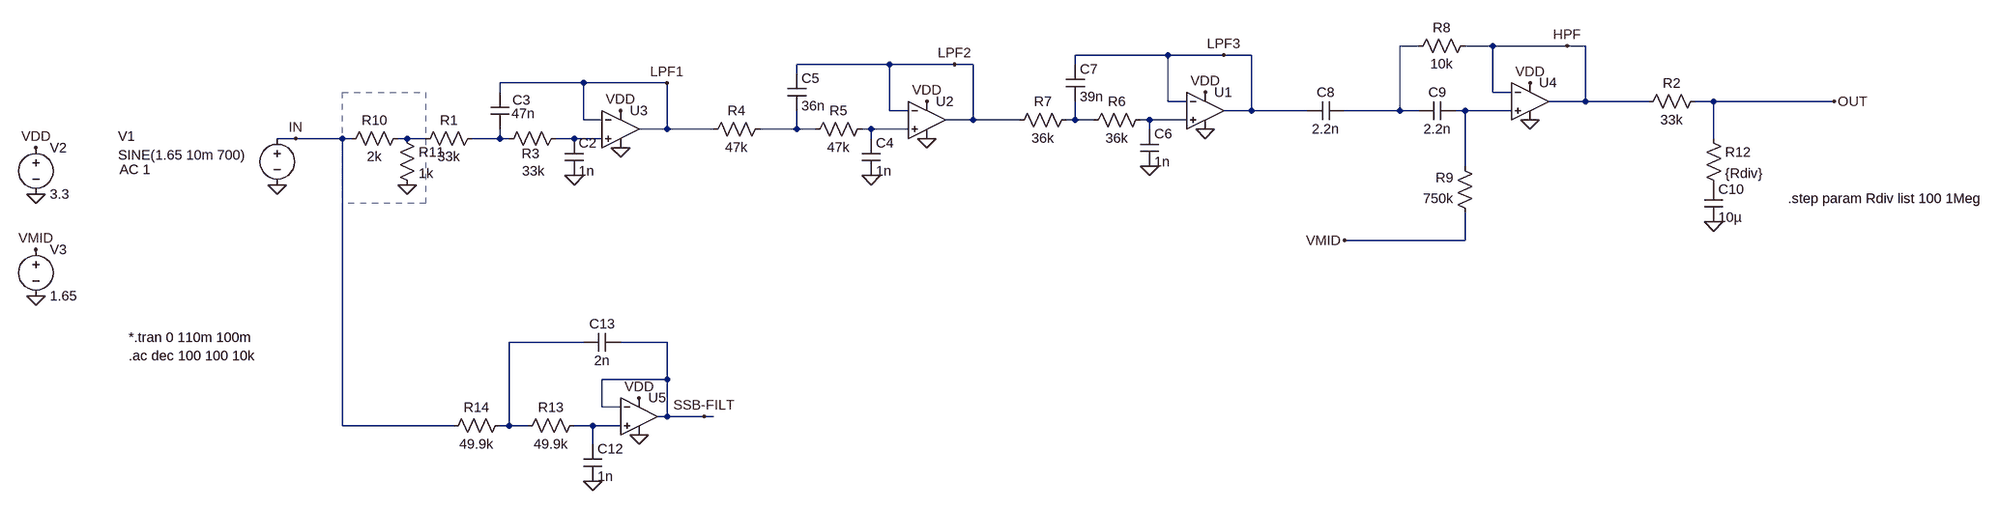
[diagram p0: schematic NM0S Hipermite - Modified.asc]
NM0S Hipermite - Modified.asc, the LTspice schematic file:
Version 4
SHEET 1 3216 724
WIRE 1776 -304 1744 -304
WIRE 1904 -304 1856 -304
WIRE 2032 -304 1904 -304
WIRE 2064 -304 2032 -304
WIRE 1344 -288 1184 -288
WIRE 1440 -288 1344 -288
WIRE 1488 -288 1440 -288
WIRE 864 -272 704 -272
WIRE 976 -272 864 -272
WIRE 1008 -272 976 -272
WIRE 1184 -272 1184 -288
WIRE 704 -256 704 -272
WIRE 336 -240 192 -240
WIRE 480 -240 336 -240
WIRE 192 -224 192 -240
WIRE 1904 -224 1904 -304
WIRE 1936 -224 1904 -224
WIRE 1344 -208 1344 -288
WIRE 1376 -208 1344 -208
WIRE 2064 -208 2064 -304
WIRE 2064 -208 2000 -208
WIRE 2256 -208 2064 -208
WIRE 2368 -208 2336 -208
WIRE 2576 -208 2368 -208
WIRE 864 -192 864 -272
WIRE 896 -192 864 -192
WIRE 1488 -192 1488 -288
WIRE 1488 -192 1440 -192
WIRE 1584 -192 1488 -192
WIRE 1744 -192 1744 -304
WIRE 1744 -192 1648 -192
WIRE 1776 -192 1744 -192
WIRE 1856 -192 1840 -192
WIRE 1936 -192 1856 -192
WIRE 336 -176 336 -240
WIRE 368 -176 336 -176
WIRE 1008 -176 1008 -272
WIRE 1008 -176 960 -176
WIRE 1088 -176 1008 -176
WIRE 1184 -176 1184 -208
WIRE 1184 -176 1168 -176
WIRE 1216 -176 1184 -176
WIRE 1312 -176 1296 -176
WIRE 1376 -176 1312 -176
WIRE 480 -160 480 -240
WIRE 480 -160 432 -160
WIRE 560 -160 480 -160
WIRE 704 -160 704 -192
WIRE 704 -160 640 -160
WIRE 736 -160 704 -160
WIRE 832 -160 816 -160
WIRE 896 -160 832 -160
WIRE 1312 -160 1312 -176
WIRE -160 -144 -192 -144
WIRE -80 -144 -160 -144
WIRE -64 -144 -80 -144
WIRE 32 -144 16 -144
WIRE 64 -144 32 -144
WIRE 192 -144 192 -160
WIRE 192 -144 144 -144
WIRE 208 -144 192 -144
WIRE 320 -144 288 -144
WIRE 368 -144 320 -144
WIRE 832 -144 832 -160
WIRE 2368 -144 2368 -208
WIRE 1856 -96 1856 -192
WIRE 1856 32 1856 -16
WIRE 1856 32 1648 32
WIRE 336 208 208 208
WIRE 480 208 400 208
WIRE 480 272 480 208
WIRE 480 272 368 272
WIRE 368 320 368 272
WIRE 400 320 368 320
WIRE 480 336 480 272
WIRE 480 336 464 336
WIRE 544 336 480 336
WIRE 560 336 544 336
WIRE -80 352 -80 -144
WIRE 112 352 -80 352
WIRE 208 352 208 208
WIRE 208 352 192 352
WIRE 240 352 208 352
WIRE 352 352 320 352
WIRE 400 352 352 352
WIRE 352 384 352 352
FLAG -608 -48 0
FLAG -608 -128 VDD
FLAG -192 -64 0
FLAG 320 -80 0
FLAG 832 -80 0
FLAG 1312 -96 0
FLAG 1968 -240 VDD
FLAG 1968 -176 0
FLAG 1408 -224 VDD
FLAG 1408 -160 0
FLAG 928 -208 VDD
FLAG 928 -144 0
FLAG 400 -192 VDD
FLAG 400 -128 0
FLAG 480 -240 LPF1
FLAG 976 -272 LPF2
FLAG 1440 -288 LPF3
FLAG 2032 -304 HPF
FLAG 2576 -208 OUT
FLAG -160 -144 IN
FLAG -608 128 0
FLAG -608 48 VMID
FLAG 1648 32 VMID
FLAG 2368 0 0
FLAG 432 304 VDD
FLAG 432 368 0
FLAG 544 336 SSB-FILT
FLAG 352 448 0
FLAG 32 -64 0
SYMBOL voltage -192 -160 R0
WINDOW 123 -272 70 Left 2
WINDOW 39 0 0 Left 0
WINDOW 0 -274 12 Left 2
WINDOW 3 -274 45 Left 2
SYMATTR Value2 AC 1
SYMATTR InstName V1
SYMATTR Value SINE(1.65 10m 700)
SYMBOL voltage -608 -144 R0
WINDOW 123 0 0 Left 0
WINDOW 39 0 0 Left 0
SYMATTR InstName V2
SYMATTR Value 3.3
SYMBOL res 160 -160 R90
WINDOW 0 0 56 VBottom 2
WINDOW 3 32 56 VTop 2
SYMATTR InstName R1
SYMATTR Value 33k
SYMBOL res 304 -160 R90
WINDOW 0 58 59 VBottom 2
WINDOW 3 57 54 VTop 2
SYMATTR InstName R3
SYMATTR Value 33k
SYMBOL cap 304 -144 R0
SYMATTR InstName C2
SYMATTR Value 1n
SYMBOL cap 176 -224 R0
WINDOW 0 38 14 Left 2
WINDOW 3 36 37 Left 2
SYMATTR InstName C3
SYMATTR Value 47n
SYMBOL res 656 -176 R90
WINDOW 0 0 56 VBottom 2
WINDOW 3 32 56 VTop 2
SYMATTR InstName R4
SYMATTR Value 47k
SYMBOL res 832 -176 R90
WINDOW 0 0 56 VBottom 2
WINDOW 3 32 56 VTop 2
SYMATTR InstName R5
SYMATTR Value 47k
SYMBOL cap 816 -144 R0
SYMATTR InstName C4
SYMATTR Value 1n
SYMBOL cap 688 -256 R0
SYMATTR InstName C5
SYMATTR Value 36n
SYMBOL res 1312 -192 R90
WINDOW 0 0 56 VBottom 2
WINDOW 3 32 56 VTop 2
SYMATTR InstName R6
SYMATTR Value 36k
SYMBOL cap 1296 -160 R0
SYMATTR InstName C6
SYMATTR Value 1n
SYMBOL cap 1168 -272 R0
SYMATTR InstName C7
SYMATTR Value 39n
SYMBOL res 1184 -192 R90
WINDOW 0 0 56 VBottom 2
WINDOW 3 32 56 VTop 2
SYMATTR InstName R7
SYMATTR Value 36k
SYMBOL cap 1648 -208 R90
WINDOW 0 0 32 VBottom 2
WINDOW 3 32 32 VTop 2
SYMATTR InstName C8
SYMATTR Value 2.2n
SYMBOL OpAmps\\UniversalOpAmp 1968 -208 R0
SYMATTR InstName U4
SYMBOL res 1872 -320 R90
WINDOW 0 0 56 VBottom 2
WINDOW 3 32 56 VTop 2
SYMATTR InstName R8
SYMATTR Value 10k
SYMBOL cap 1840 -208 R90
WINDOW 0 0 32 VBottom 2
WINDOW 3 32 32 VTop 2
SYMATTR InstName C9
SYMATTR Value 2.2n
SYMBOL res 1872 0 R180
WINDOW 0 36 76 Left 2
WINDOW 3 36 40 Left 2
SYMATTR InstName R9
SYMATTR Value 750k
SYMBOL OpAmps\\UniversalOpAmp 1408 -192 R0
SYMATTR InstName U1
SYMBOL OpAmps\\UniversalOpAmp 928 -176 R0
SYMATTR InstName U2
SYMBOL OpAmps\\UniversalOpAmp 400 -160 R0
SYMATTR InstName U3
SYMBOL voltage -608 32 R0
WINDOW 123 0 0 Left 0
WINDOW 39 0 0 Left 0
SYMATTR InstName V3
SYMATTR Value 1.65
SYMBOL res 2352 -224 R90
WINDOW 0 0 56 VBottom 2
WINDOW 3 32 56 VTop 2
SYMATTR InstName R2
SYMATTR Value 33k
SYMBOL res 2352 -160 R0
SYMATTR InstName R12
SYMATTR Value {Rdiv}
SYMBOL cap 2352 -64 R0
SYMATTR InstName C10
SYMATTR Value 10µ
SYMBOL OpAmps\\UniversalOpAmp 432 336 R0
SYMATTR InstName U5
SYMBOL res 336 336 R90
WINDOW 0 0 56 VBottom 2
WINDOW 3 32 56 VTop 2
SYMATTR InstName R13
SYMATTR Value 49.9k
SYMBOL res 208 336 R90
WINDOW 0 0 56 VBottom 2
WINDOW 3 32 56 VTop 2
SYMATTR InstName R14
SYMATTR Value 49.9k
SYMBOL cap 336 384 R0
SYMATTR InstName C12
SYMATTR Value 1n
SYMBOL cap 400 192 R90
WINDOW 0 0 32 VBottom 2
WINDOW 3 32 32 VTop 2
SYMATTR InstName C13
SYMATTR Value 2n
SYMBOL res 32 -160 R90
WINDOW 0 0 56 VBottom 2
WINDOW 3 32 56 VTop 2
SYMATTR InstName R10
SYMATTR Value 2k
SYMBOL res 16 -160 R0
SYMATTR InstName R11
SYMATTR Value 1k
TEXT -448 200 Left 2 !*.tran 0 110m 100m\n.ac dec 100 100 10k
TEXT 2496 -40 Left 2 !.step param Rdiv list 100 1Meg
RECTANGLE Normal 64 -32 -80 -224 2

The netlist it stands for:
* NM0S Hipermite - Modified.asc
V1 IN 0 SINE(1.65 10m 700) AC 1
V2 VDD 0 3.3
R1 N008 N007 33k
R3 N009 N008 33k
C2 N009 0 1n
C3 LPF1 N008 47n
R4 N005 LPF1 47k
R5 N006 N005 47k
C4 N006 0 1n
C5 LPF2 N005 36n
R6 N004 N003 36k
C6 N004 0 1n
C7 LPF3 N003 39n
R7 N003 LPF2 36k
C8 N001 LPF3 2.2n
XU4 N002 HPF VDD 0 HPF level1 Avol=1Meg GBW=10Meg Vos=0 En=0 Enk=0 In=0 Ink=0 Rin=500Meg  ; pins In+ In- V+ V- OUT
R8 HPF N001 10k
C9 N002 N001 2.2n
R9 VMID N002 750k
XU1 N004 LPF3 VDD 0 LPF3 level1 Avol=1Meg GBW=10Meg Vos=0 En=0 Enk=0 In=0 Ink=0 Rin=500Meg  ; pins In+ In- V+ V- OUT
XU2 N006 LPF2 VDD 0 LPF2 level1 Avol=1Meg GBW=10Meg Vos=0 En=0 Enk=0 In=0 Ink=0 Rin=500Meg  ; pins In+ In- V+ V- OUT
XU3 N009 LPF1 VDD 0 LPF1 level1 Avol=1Meg GBW=10Meg Vos=0 En=0 Enk=0 In=0 Ink=0 Rin=500Meg  ; pins In+ In- V+ V- OUT
V3 VMID 0 1.65
R2 OUT HPF 33k
R12 OUT P001 {Rdiv}
C10 P001 0 10µ
XU5 N011 SSB-FILT VDD 0 SSB-FILT level1 Avol=1Meg GBW=10Meg Vos=0 En=0 Enk=0 In=0 Ink=0 Rin=500Meg  ; pins In+ In- V+ V- OUT
R13 N011 N010 49.9k
R14 N010 IN 49.9k
C12 N011 0 1n
C13 SSB-FILT N010 2n
R10 N007 IN 2k
R11 N007 0 1k
*.tran 0 110m 100m
.ac dec 100 100 10k
.step param Rdiv list 100 1Meg
.lib UniversalOpAmp1.lib
.backanno
.end